# EAGLE design quad.decay.v1.0.1 (EAGLE 7.7.0)
VCA
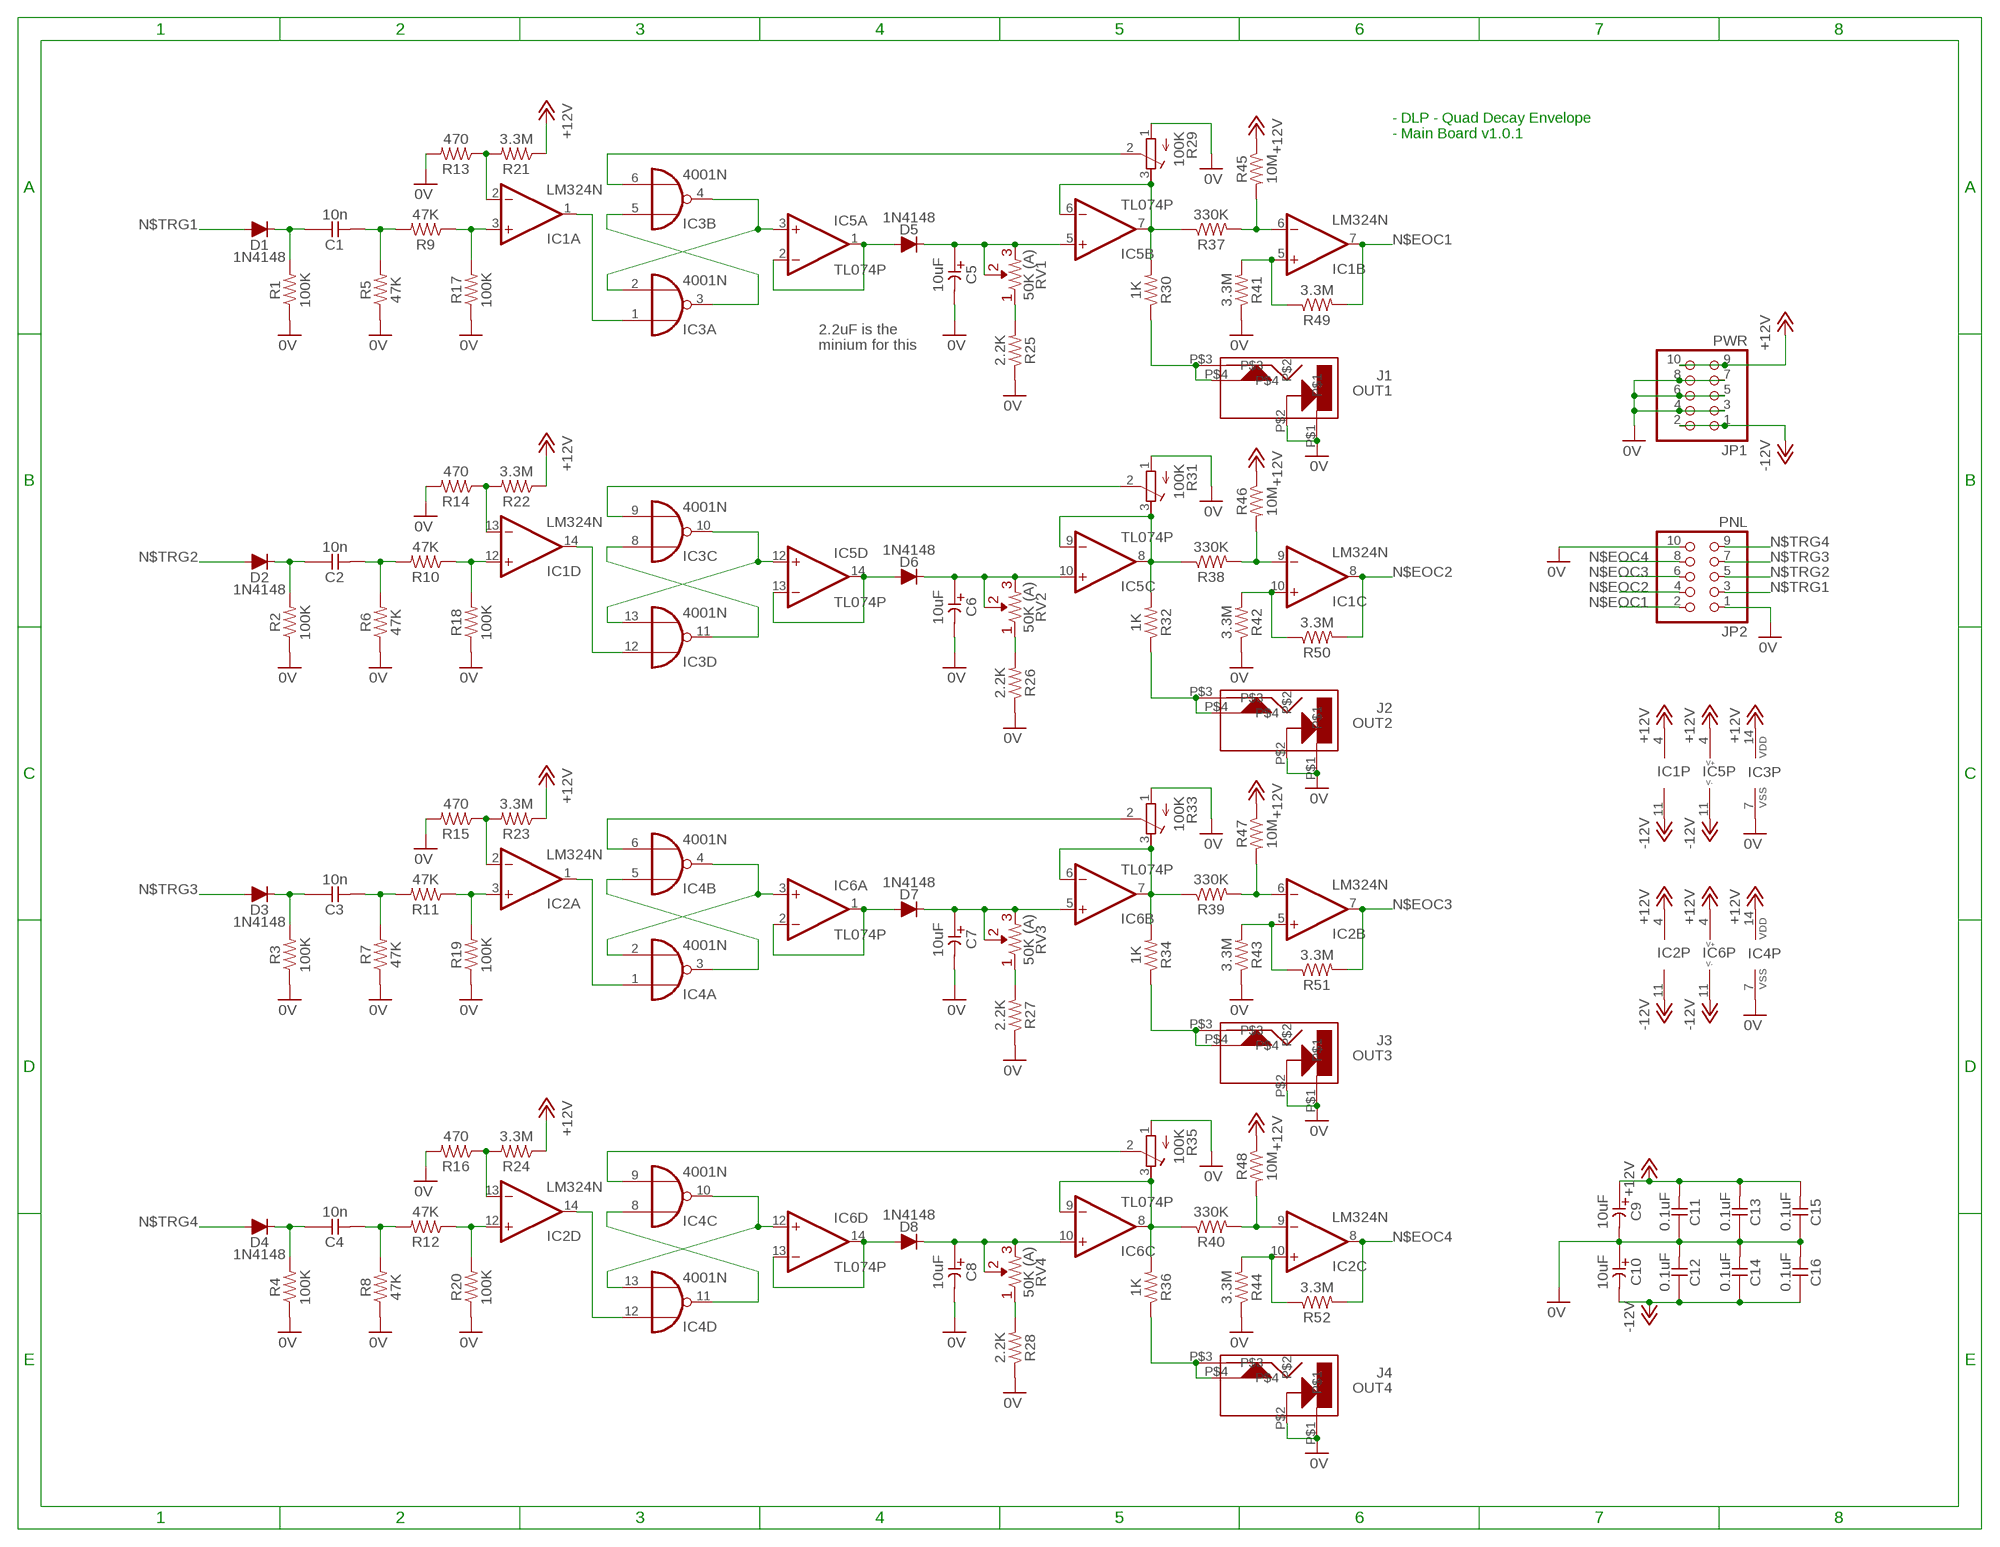
[diagram p0: schematic, sheet 1]

## Parts
C1  10n  CC-US025-024X044  [C025-024X044]
C2  10n  CC-US025-024X044  [C025-024X044]
C3  10n  CC-US025-024X044  [C025-024X044]
C4  10n  CC-US025-024X044  [C025-024X044]
C5  10uF  CE-USE2-5  [E2-5]
C6  10uF  CE-USE2-5  [E2-5]
C7  10uF  CE-USE2-5  [E2-5]
C8  10uF  CE-USE2-5  [E2-5]
C9  10uF  CE-USE2-5  [E2-5]
C10  10uF  CE-USE2-5  [E2-5]
C11  0.1uF  CC-US025-024X044  [C025-024X044]
C12  0.1uF  CC-US025-024X044  [C025-024X044]
C13  0.1uF  CC-US025-024X044  [C025-024X044]
C14  0.1uF  CC-US025-024X044  [C025-024X044]
C15  0.1uF  CC-US025-024X044  [C025-024X044]
C16  0.1uF  CC-US025-024X044  [C025-024X044]
D1  1N4148  [DO34-5]
D2  1N4148  [DO34-5]
D3  1N4148  [DO34-5]
D4  1N4148  [DO34-5]
D5  1N4148  [DO34-5]
D6  1N4148  [DO34-5]
D7  1N4148  [DO34-5]
D8  1N4148  [DO34-5]
IC1  LM324N  [DIL14]
IC2  LM324N  [DIL14]
IC3  4001N  [DIL14]
IC4  4001N  [DIL14]
IC5  TL074P  [DIL14]
IC6  TL074P  [DIL14]
J1  OUT1  CL1384  [CL1384]
J2  OUT2  CL1384  [CL1384]
J3  OUT3  CL1384  [CL1384]
J4  OUT4  CL1384  [CL1384]
JP1  PWR  PINHD-2X5  [2X05]
JP2  PNL  PINHD-2X5  [2X05]
R1  100K  R  [0207/7]
R2  100K  R  [0207/7]
R3  100K  R  [0207/7]
R4  100K  R  [0207/7]
R5  47K  R  [0207/7]
R6  47K  R  [0207/7]
R7  47K  R  [0207/7]
R8  47K  R  [0207/7]
R9  47K  R  [0207/7]
R10  47K  R  [0207/7]
R11  47K  R  [0207/7]
R12  47K  R  [0207/7]
R13  470  R  [0207/7]
R14  470  R  [0207/7]
R15  470  R  [0207/7]
R16  470  R  [0207/7]
R17  100K  R  [0207/7]
R18  100K  R  [0207/7]
R19  100K  R  [0207/7]
R20  100K  R  [0207/7]
R21  3.3M  R  [0207/7]
R22  3.3M  R  [0207/7]
R23  3.3M  R  [0207/7]
R24  3.3M  R  [0207/7]
R25  2.2K  R  [0207/7]
R26  2.2K  R  [0207/7]
R27  2.2K  R  [0207/7]
R28  2.2K  R  [0207/7]
R29  100K  R-TRIMM3339P  [RTRIM3339P]
R30  1K  R  [0207/7]
R31  100K  R-TRIMM3339P  [RTRIM3339P]
R32  1K  R  [0207/7]
R33  100K  R-TRIMM3339P  [RTRIM3339P]
R34  1K  R  [0207/7]
R35  100K  R-TRIMM3339P  [RTRIM3339P]
R36  1K  R  [0207/7]
R37  330K  R  [0207/7]
R38  330K  R  [0207/7]
R39  330K  R  [0207/7]
R40  330K  R  [0207/7]
R41  3.3M  R  [0207/7]
R42  3.3M  R  [0207/7]
R43  3.3M  R  [0207/7]
R44  3.3M  R  [0207/7]
R45  10M  R  [0207/7]
R46  10M  R  [0207/7]
R47  10M  R  [0207/7]
R48  10M  R  [0207/7]
R49  3.3M  R  [0207/7]
R50  3.3M  R  [0207/7]
R51  3.3M  R  [0207/7]
R52  3.3M  R  [0207/7]
RV1  50K (A)  R-VAR  [R-VAR]
RV2  50K (A)  R-VAR  [R-VAR]
RV3  50K (A)  R-VAR  [R-VAR]
RV4  50K (A)  R-VAR  [R-VAR]

## Nets
0V [pwr]: C5.- C6.- C7.- C8.- C9.- C10.+ C11.1 C12.2 C13.1 C14.2 C15.1 C16.2 IC3.7(P:VSS) IC4.7(P:VSS) J1.P$1 J1.P$2 J2.P$1 J2.P$2 J3.P$1 J3.P$2 J4.P$1 J4.P$2 JP1.3 JP1.4 JP1.5 JP1.6 JP1.7 JP1.8 JP2.1 JP2.10 R1.1 R2.1 R3.1 R4.1 R5.1 R6.1 R7.1 R8.1 R13.2 R14.2 R15.2 R16.2 R17.1 R18.1 R19.1 R20.1 R25.1 R26.1 R27.1 R28.1 R29.1(A) R31.1(A) R33.1(A) R35.1(A) R41.1 R42.1 R43.1 R44.1
+12V [pwr]: C9.+ C11.2 C13.2 C15.2 IC1.4(P:V+) IC2.4(P:V+) IC3.14(P:VDD) IC4.14(P:VDD) IC5.4(P:V+) IC6.4(P:V+) JP1.9 JP1.10 R21.1 R22.1 R23.1 R24.1 R45.1 R46.1 R47.1 R48.1
-12V [pwr]: C10.- C12.1 C14.1 C16.1 IC1.11(P:V-) IC2.11(P:V-) IC5.11(P:V-) IC6.11(P:V-) JP1.1 JP1.2
N$1: R25.2 RV1.R1
N$2: IC1.6(B:-IN) R37.2 R45.2
N$3: IC1.5(B:+IN) R41.2 R49.1
N$4: IC3.3(A:O) IC3.5(B:I0)
N$8: IC3.8(C:I0) IC3.11(D:O)
N$9: IC3.10(C:O) IC3.13(D:I1) IC5.12(D:+IN)
N$11: C2.1 D2.C R2.2
N$12: C2.2 R6.2 R10.2
N$13: IC1.12(D:+IN) R10.1 R18.2
N$14: IC3.2(A:I1) IC3.4(B:O) IC5.3(A:+IN)
N$16: IC1.13(D:-IN) R14.1 R22.2
N$17: D5.A IC5.1(A:OUT) IC5.2(A:-IN)
N$18: C1.1 D1.C R1.2
N$19: C1.2 R5.2 R9.2
N$20: IC1.3(A:+IN) R9.1 R17.2
N$21: IC1.2(A:-IN) R13.1 R21.2
N$22: IC1.1(A:OUT) IC3.1(A:I0)
N$23: IC5.6(B:-IN) IC5.7(B:OUT) R29.3(E) R30.2 R37.1
N$24: J1.P$3 J1.P$4 R30.1
N$25: IC3.6(B:I1) R29.2(S)
N$26: IC1.14(D:OUT) IC3.12(D:I0)
N$27: D6.A IC5.13(D:-IN) IC5.14(D:OUT)
N$28: IC5.8(C:OUT) IC5.9(C:-IN) R31.3(E) R32.2 R38.1
N$29: J2.P$3 J2.P$4 R32.1
N$30: IC3.9(C:I1) R31.2(S)
N$31: C6.+ D6.C IC5.10(C:+IN) RV2.R2 RV2.VAR
N$32: R26.2 RV2.R1
N$33: IC1.9(C:-IN) R38.2 R46.2
N$34: IC1.10(C:+IN) R42.2 R50.1
N$38: IC4.3(A:O) IC4.5(B:I0)
N$39: IC4.2(A:I1) IC4.4(B:O) IC6.3(A:+IN)
N$41: C3.1 D3.C R3.2
N$42: C3.2 R7.2 R11.2
N$43: IC2.3(A:+IN) R11.1 R19.2
N$44: IC2.2(A:-IN) R15.1 R23.2
N$45: IC2.1(A:OUT) IC4.1(A:I0)
N$46: D7.A IC6.1(A:OUT) IC6.2(A:-IN)
N$47: IC6.6(B:-IN) IC6.7(B:OUT) R33.3(E) R34.2 R39.1
N$48: J3.P$3 J3.P$4 R34.1
N$49: IC4.6(B:I1) R33.2(S)
N$50: C7.+ D7.C IC6.5(B:+IN) RV3.R2 RV3.VAR
N$51: R27.2 RV3.R1
N$52: IC2.6(B:-IN) R39.2 R47.2
N$53: IC2.5(B:+IN) R43.2 R51.1
N$57: IC4.8(C:I0) IC4.11(D:O)
N$58: IC4.10(C:O) IC4.13(D:I1) IC6.12(D:+IN)
N$60: C4.1 D4.C R4.2
N$61: C4.2 R8.2 R12.2
N$62: IC2.12(D:+IN) R12.1 R20.2
N$63: C5.+ D5.C IC5.5(B:+IN) RV1.R2 RV1.VAR
N$64: IC2.13(D:-IN) R16.1 R24.2
N$65: IC2.14(D:OUT) IC4.12(D:I0)
N$66: D8.A IC6.13(D:-IN) IC6.14(D:OUT)
N$67: IC6.8(C:OUT) IC6.9(C:-IN) R35.3(E) R36.2 R40.1
N$68: J4.P$3 J4.P$4 R36.1
N$69: IC4.9(C:I1) R35.2(S)
N$70: C8.+ D8.C IC6.10(C:+IN) RV4.R2 RV4.VAR
N$71: R28.2 RV4.R1
N$72: IC2.9(C:-IN) R40.2 R48.2
N$73: IC2.10(C:+IN) R44.2 R52.1
N$EOC1: IC1.7(B:OUT) JP2.2 R49.2
N$EOC2: IC1.8(C:OUT) JP2.4 R50.2
N$EOC3: IC2.7(B:OUT) JP2.6 R51.2
N$EOC4: IC2.8(C:OUT) JP2.8 R52.2
N$TRG1: D1.A JP2.3
N$TRG2: D2.A JP2.5
N$TRG3: D3.A JP2.7
N$TRG4: D4.A JP2.9

## Notes on the sheet
- - DLP - Quad Decay Envelope
  - Main Board v1.0.1
- 2.2uF is the 
  minium for this

## Library data of the parts
C1-C4 C11-C16 = _common:CC-US: CAPACITOR, US symbol
C5-C10 = _common:CE-US: ELECTROLYTIC CAPACITOR, US symbol
D1-D8 = _common:1N4148: DIODE high speed (Philips)
IC1 IC2 = linear:LM324: OP AMP
IC3 IC4 = 40xx:4001: Quad 2-input NOR
IC5 IC6 = _common:TL074: OP AMP
J1-J4 = jacks:CL1384
JP1 JP2 = pinhead:PINHD-2X5: PIN HEADER
R1-R28 R30 R32 R34 R36-R52 = _common:R: RESISTOR, US symbol
R29 R31 R33 R35 = rcl:R-TRIMM: Trimm resistor
RV1-RV4 = _common:R-VAR

## Net classes
1 pwr: width 0.508 mm

## Board
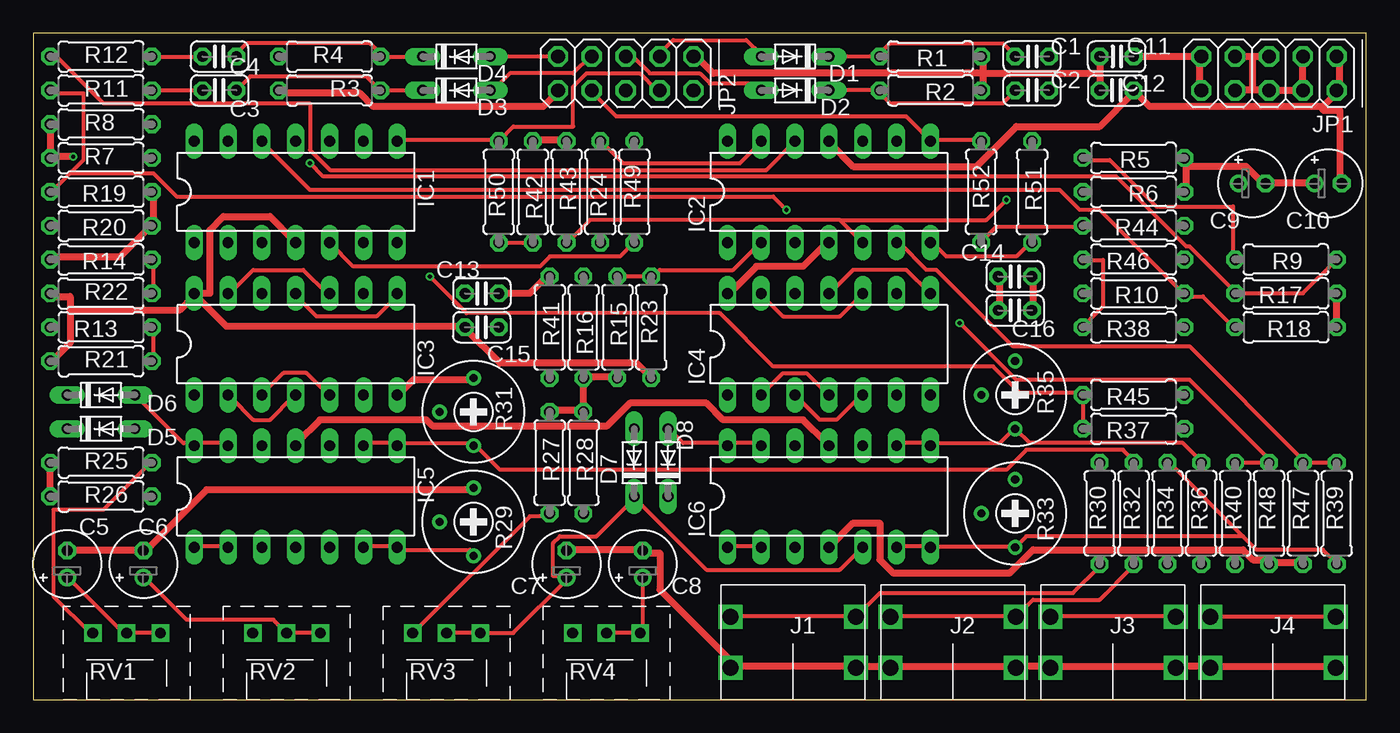
[diagram p1: board, top side]
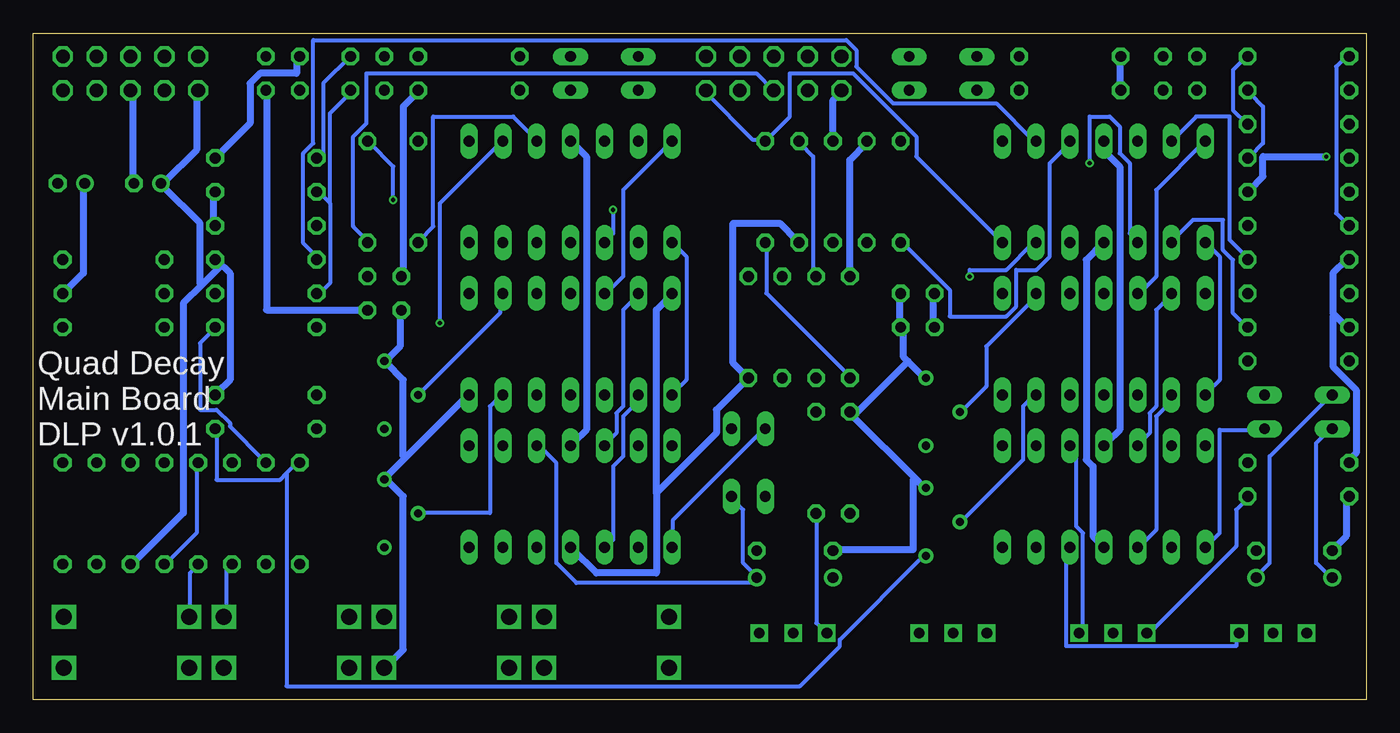
[diagram p2: board, bottom side, seen from below]

Size 100 x 50 mm. Coordinates in mm from the lower left corner, seen from the top.
Outline: 0,0 100,0 100,50 0,50 0,0
Copper layers (1*16): Top 0.035mm / dielectric 1.5mm / Bottom 0.035mm
Design rules "SeeedStudio_2layer_DRU_no_angle_20140221 *": minimum track width 12mil, minimum drill 12mil, track to track 6mil, track to pad 6mil, pad to pad 6mil, via to via 6mil, smd to smd 0mil, copper to edge 10mil, drill to drill 10mil, minimum pad ring 10mil, minimum via ring 6mil, stop-mask expansion 2mil, vias tented up to drill 100mil, thermal gap 10mil

### Footprints (pad centres in the part's own frame; a part is rotated, then mirrored left to right if it is on the bottom)
C025-024X044 = drill 0.813 octagon: 1 -1.27,0; 2 1.27,0
E2-5 = drill 0.813 pad 1.27: + -1.016,0 | drill 0.813 pad 1.27 octagon: - 1.016,0
DO34-5 = drill 0.813 long: A 2.54,0; C -2.54,0
DIL14 = drill 0.813 long: 1 -7.62,-3.81; 2 -5.08,-3.81; 3 -2.54,-3.81; 4 0,-3.81; 5 2.54,-3.81; 6 5.08,-3.81; 7 7.62,-3.81; 8 7.62,3.81; 9 5.08,3.81; 10 2.54,3.81; 11 0,3.81; 12 -2.54,3.81; 13 -5.08,3.81; 14 -7.62,3.81
CL1384 = drill 1.2 square: P$1 0,0; P$2 9.4,0; P$3 0,-3.8; P$4 9.4,-3.8
2X05 = drill 1.016 octagon: 1 -5.08,-1.27; 2 -5.08,1.27; 3 -2.54,-1.27; 4 -2.54,1.27; 5 0,-1.27; 6 0,1.27; 7 2.54,-1.27; 8 2.54,1.27; 9 5.08,-1.27; 10 5.08,1.27
0207/7 = drill 0.813 octagon: 1 -3.81,0; 2 3.81,0
RTRIM3339P = drill 0.61: 1 -2.54,0; 2 0,-2.54; 3 2.54,0
R-VAR = drill 0.8 square: R1 -2.54,0; R2 2.54,0; VAR 0,0

### Placement (x,y rotation side)
C1  74.93,48.26 0 top
C2  74.93,45.72 0 top
C3  13.97,45.72 180 top
C4  13.97,48.26 180 top
C5  2.54,10.16 90 top
C6  8.26,10.16 90 top
C7  40.01,10.16 90 top
C8  45.72,10.16 90 top
C9  91.44,38.73 0 top
C10  97.16,38.73 0 top
C11  81.28,48.26 0 top
C12  81.28,45.72 180 top
C13  33.66,30.48 180 top
C14  73.66,31.75 180 top
C15  33.66,27.94 180 top
C16  73.66,29.21 180 top
D1  57.15,48.26 180 top
D2  57.15,45.72 180 top
D3  31.75,45.72 0 top
D4  31.75,48.26 0 top
D5  5.08,20.32 0 top
D6  5.08,22.86 0 top
D7  45.09,17.78 90 top
D8  47.62,17.78 90 top
IC1  19.68,38.1 0 top
IC2  59.69,38.1 0 top
IC3  19.68,26.67 0 top
IC4  59.69,26.67 0 top
IC5  19.68,15.24 0 top
IC6  59.69,15.24 0 top
J1  61.7,2.4 180 top
J2  73.7,2.4 180 top
J3  85.7,2.4 180 top
J4  97.7,2.4 180 top
JP1  92.71,46.99 180 top
JP2  44.45,46.99 180 top
R1  67.31,48.26 180 top
R2  67.31,45.72 180 top
R3  22.23,45.72 0 top
R4  22.23,48.26 0 top
R5  82.55,40.64 180 top
R6  82.55,38.1 180 top
R7  5.08,40.64 0 top
R8  5.08,43.18 0 top
R9  93.98,33.02 180 top
R10  82.55,30.48 180 top
R11  5.08,45.72 0 top
R12  5.08,48.26 0 top
R13  5.08,27.94 180 top
R14  5.08,33.02 180 top
R15  43.81,27.94 270 top
R16  41.27,27.94 270 top
R17  93.98,30.48 180 top
R18  93.98,27.94 180 top
R19  5.08,38.1 180 top
R20  5.08,35.56 180 top
R21  5.08,25.4 0 top
R22  5.08,30.48 0 top
R23  46.35,27.94 90 top
R24  42.55,38.1 90 top
R25  5.08,17.78 0 top
R26  5.08,15.24 0 top
R27  38.73,17.78 270 top
R28  41.27,17.78 270 top
R29  33.02,13.34 270 top
R30  80.01,13.97 90 top
R31  33.02,21.59 270 top
R32  82.55,13.97 90 top
R33  73.66,13.97 270 top
R34  85.09,13.97 90 top
R35  73.66,22.86 270 top
R36  87.63,13.97 90 top
R37  82.55,20.32 180 top
R38  82.55,27.94 180 top
R39  97.79,13.97 90 top
R40  90.17,13.97 90 top
R41  38.73,27.94 270 top
R42  37.47,38.1 270 top
R43  40.01,38.1 270 top
R44  82.55,35.56 180 top
R45  82.55,22.86 180 top
R46  82.55,33.02 180 top
R47  95.25,13.97 90 top
R48  92.71,13.97 90 top
R49  45.09,38.1 90 top
R50  34.92,38.1 90 top
R51  74.93,38.1 270 top
R52  71.12,38.1 90 top
RV1  7,5 0 top
RV2  19,5 0 top
RV3  31,5 0 top
RV4  43,5 0 top

### Tracks (layer width: path | path; a pad name or v marks a point on that pad's centre or on a via)
0V  (via drill 0.3)
  Top 0.508: 91.5,48.25 92.5,48.25 JP1.5 | 91.5,48.25 90.25,48.25 JP1.7 | 91.5,45.75 92.5,45.75 JP1.6 92.75,45.75 95.25,45.75 JP1.4 JP1.3 | 91.5,45.75 90.25,45.75 JP1.8 | 91.5,45.75 91.5,48.25 | 86.5,40 86.5,38.25 R6.1 | 86.5,40 86.5,40.5 R5.1 | R18.1 97.75,28 97.75,30.25 R17.1 | C10.+ 96,38.75 92.5,38.75 C9.- 92.25,38.75 91,40 86.5,40 | C14.2 72.5,31.75 72.5,29.25 C16.2 | 80,47 C11.1 | 80,47 80,45.75 C12.2 | 71.25,47 71.25,48.25 R1.1 | 71.25,47 71.25,45.75 R2.1 | 71.25,47 51,47 49.75,48.25 JP2.1 | 71.25,47 80,47 | J4.P$1 97.5,2.5 88.5,2.5 J4.P$2 88.25,2.5 85.75,2.5 J3.P$1 85.5,2.5 76.5,2.5 J3.P$2 76.25,2.5 73.75,2.5 J2.P$1 73.5,2.5 64.5,2.5 J2.P$2 64.25,2.5 61.75,2.5 J1.P$1 61.5,2.5 52.5,2.5 J1.P$2 52.5,2.75 47,8.25 47,11 45.75,11 C8.- 45.5,11.25 40.25,11.25 C7.- | C5.- 2.75,11.25 8.25,11.25 C6.- 8.5,11.25 13,15.75 33,15.75 R29.1 | R25.1 1.25,17.75 1.25,15.25 R26.1 | R8.1 1.25,43 1.25,40.75 R7.1 1.5,40.75 v3,40.75 | R19.1 9,38 9,35.75 R20.1 8.75,35.5 6.5,33.25 1.5,33.25 R14.2 | R42.1 37.5,42 40,42 R43.1 | R3.1 18.5,45.5 24.5,45.5 25.5,44.5 38.25,44.5 39.25,45.5 JP2.10 | IC3.7 27.5,23 28.5,24 33,24 R31.1 | R41.1 38.5,31.75 37.25,30.5 35,30.5 C13.1 | R15.2 43.75,24.25 41.5,24.25 R16.2 41.25,24 41.25,21.75 R28.1 41,21.75 38.75,21.75 R27.1
  Bottom 0.508: R44.1 86.5,35.75 86.5,38 R6.1 | R17.1 97.75,30.5 96.25,32 96.25,38.5 C10.+ | JP1.6 92.5,45.5 92.5,38.75 C9.- | C16.2 72.5,29 72.5,26.5 73.5,25.5 R35.1 73.5,25.25 72.25,24 72.25,18.25 72.12,18.12 | 72.12,18.12 67.5,22.75 IC4.7 | 72.12,18.12 73.5,16.75 R33.1 73.5,16.5 72.25,15.25 72.25,3.75 73.5,2.5 J2.P$1 | C14.2 72.25,31.75 72.25,44.5 71.25,45.5 R2.1 | R5.1 83.75,43.25 83.75,46.25 83,47 80.25,47 80.25,48.25 C11.1 | C5.- 2.5,11.25 1.5,12.25 1.5,15 R26.1 | 2.38,28.88 2.5,29 2.5,32 1.5,33 R14.2 | 2.38,28.88 1.5,28 R13.2 | v3,40.75 7.75,40.75 7.75,39.25 8.75,38.25 R19.1 | R25.1 1.25,18 0.75,18.5 0.75,23.25 2.5,25 2.5,28.75 2.38,28.88 | R3.1 18.5,45.75 18.5,48.25 R4.1 | JP2.10 39.5,45.5 40,45 40,42 R43.1 | 34.38,25.38 34.75,25.75 34.75,27.75 C15.1 35,28 35,30.25 C13.1 | 34.38,25.38 33.25,24.25 R31.1 | 33.88,16.62 38.5,21.25 38.5,21.5 R27.1 38.25,21.5 34.38,25.38 | 33.88,16.62 33.25,16 R29.1 | C7.- 40,11.25 34,11.25 34,16.5 33.88,16.62 | R42.1 37.5,41.75 38.75,40.5 38.75,31.75 R41.1
+12V
  Top 0.508: C11.2 82.75,48.25 87.5,48.25 JP1.9 87.5,48 87.5,45.75 JP1.10 | R47.1 95.25,10.25 92.75,10.25 R48.1 92.5,10.25 92.25,10.5 91.5,10.5 90.75,11.25 75,11.25 73.25,9.5 64.5,9.5 63.5,10.5 63.5,13.25 61.5,13.25 59.75,11.5 IC6.4 | 2.75,29.25 2.75,30.25 1.5,30.25 R22.1 | 2.75,29.25 2.75,26.75 1.5,25.5 R21.1 | 2.75,29.25 11,29.25 12,30.25 IC3.14 | IC4.14 52.25,30.5 54.25,32.5 57.75,32.5 59.5,34.25 IC2.4 | R23.1 46.25,24.25 45.25,25.25 35,25.25 32.5,27.75 C15.2 32.25,28 14.5,28 12.25,30.25 IC3.14 | IC1.4 19.5,34.5 17.75,36.25 14.25,36.25 13.25,35.25 13.25,30.5 12.25,30.5 IC3.14
  Bottom 0.508: JP1.10 87.75,45.5 87.75,41.25 90.25,38.75 C9.+ 90.25,38.5 87.5,35.75 87.5,31.25 87.38,31.12 | R45.1 86.25,23 85.25,24 85.25,32 86.25,33 R46.1 86,32.5 87.38,31.12 | 87.38,31.12 88.75,29.75 88.75,14 92.5,10.25 R48.1 | IC5.4 19.75,11.5 20.5,12.25 20.5,17.5 21,18 21,33 19.75,34.25 IC1.4 | C15.2 32.5,28 32.5,30.25 C13.2 | R24.1 42.75,34.5 44,35.75 47.5,35.75 47.5,25.25 46.5,24.25 R23.1 46.5,24 48.75,21.75 48.75,20 53.25,15.5 | 53.25,15.5 53.25,9.5 57.75,9.5 59.5,11.25 IC6.4 | 53.25,15.5 53.25,29.25 52.25,30.25 IC4.14
-12V
  Top 0.508: C16.1 75,29.25 75,31.75 C14.1 | 96.75,44.5 83.75,44.5 82.75,45.5 C12.1 82.5,45.5 80,43 73.75,43 70.75,40 61.5,40 59.75,41.75 IC2.11 | 96.75,44.5 97.75,45.5 JP1.2 98,45.75 98,48.25 JP1.1 | C10.- 98,38.75 98,44.25 96.75,44.25 96.75,44.5 | IC5.11 19.75,19.25 21.5,21 29.5,21 30,20.5 43,20.5 44.75,22.25 50.5,22.25 51.75,21 57.75,21 59.5,19.25 IC6.11
  Bottom 0.508: C16.1 75,29.25 82.5,29.25 82.5,45.5 C12.1 | IC5.11 19.5,19.25 18.5,20.25 18.5,40 19.5,41 19.5,41.75 IC1.11 | IC6.11 59.5,19.25 58.5,20.25 58.5,40.75 59.5,41.75 IC2.11
N$1
  Top 0.305: RV1.R1 4.25,5 1.5,7.75 1.5,14.25 5.25,14.25 8.75,17.75 R25.2
N$2  (via drill 0.3)
  Top 0.305: R37.2 78.75,20.5 78.75,22.75 R45.2 78.5,23 74,23 72,25 55.5,25 51.5,29 32.5,29 v29.75,31.75
  Bottom 0.305: v29.75,31.75 29.75,32.25 27,32.25 25,34.25 IC1.6
N$3
  Top 0.305: IC1.5 22.25,34.25 24,32.5 38,32.5 38.75,33.25 44,33.25 45,34.25 R49.1
  Bottom 0.305: R41.2 38.75,24.25 45,30.5 45,34.25 R49.1
N$4
  Top 0.305: IC3.3 17.25,23 18.75,24.5 20.5,24.5 22,23 IC3.5
N$8
  Top 0.305: IC3.11 19.75,30.25 21.25,28.75 25.75,28.75 27.25,30.25 IC3.8
N$9
  Top 0.305: IC3.10 22,30.5 20.25,32.25 16.5,32.25 14.75,30.5 IC3.13
  Bottom 0.305: IC5.12 17,19.25 16.25,20 16.25,21.5 15.75,22 15.75,29.25 14.75,30.25 IC3.13
N$11
  Top 0.305: D2.C 59.75,45.75 63.5,45.75 R2.2 63.5,45.5 64.25,44.75 72.75,44.75 73.5,45.5 C2.1
N$12
  Bottom 0.305: 77.75,37.25 77.75,31.25 78.5,30.5 R10.2 | 77.75,37.25 78.5,38 R6.2 | 77.75,37.25 77.75,44 76.25,45.5 C2.2
N$13
  Top 0.305: IC1.12 17.25,41.75 20.75,38.25 77,38.25 78.5,36.75 80,36.75 86.25,30.5 R10.1 86.5,30.25 87.75,30.25 90,28 R18.2
N$14
  Top 0.305: IC3.4 19.5,22.75 17.75,21 16.5,21 14.75,22.75 IC3.2
  Bottom 0.305: IC5.3 17,11.5 15.75,12.75 15.75,21.25 14.75,22.25 14.75,22.75 IC3.2
N$16
  Top 0.305: R22.2 9,30.5 9,33 R14.1
  Bottom 0.305: IC1.13 14.5,42 12.75,43.75 10.25,43.75 10.25,34.5 9,33.25 R14.1
N$17
  Top 0.305: IC5.1 12.25,11.5 14.5,11.5 IC5.2
  Bottom 0.305: D5.A 7.75,20.25 11,20.25 11,12.5 12,11.5 IC5.1
N$18
  Top 0.305: D1.C 59.75,48.25 R1.2 63.5,48.5 64.25,49.25 72.75,49.25 73.5,48.5 C1.1
N$19
  Top 0.305: R9.2 90,33.25 90,37 84.25,37 80.75,40.5 78.75,40.5 R5.2
  Bottom 0.305: R5.2 78.5,40.75 78.25,41 78.25,46.25 76.25,48.25 C1.2
N$20  (via drill 0.3)
  Top 0.305: v20.75,40.25 21.75,39.25 81.25,39.25 86.5,34 86.75,34 90.25,30.5 | 90.25,30.5 95.25,30.5 97.75,33 R9.1 | 90.25,30.5 R17.2
  Bottom 0.305: v20.75,40.25 20.75,43.75 19.25,43.75 18.5,43 18.5,41 17.75,40.25 17.75,35 17.25,34.5 IC1.3
N$21
  Top 0.305: R21.2 9,25.5 9,27.75 R13.1
  Bottom 0.305: IC1.2 14.5,34.5 13,36 10.75,36 10.75,33.75 10,33 10,29 9,28 R13.1
N$22
  Bottom 0.305: IC3.1 12,23 11,24 11,33.25 12,34.25 IC1.1
N$23
  Top 0.305: R29.3 33,11 32.75,11.25 27.5,11.25 IC5.7 27.25,11.5 25,11.5 IC5.6
  Bottom 0.305: 81,17 81.5,16.5 86.25,16.5 86.25,20.25 R37.1 | 81,17 80.25,17.75 R30.2 | 81,17 81,1 42.5,1 39.5,4 39.5,4.5 33.25,10.75 R29.3
N$24
  Top 0.305: R30.1 80,10 78,8 63.5,8 J1.P$3 61.5,6.25 52.5,6.25 J1.P$4
N$25
  Bottom 0.305: R29.2 30.25,13.5 25.75,18 25.75,22 25,22.75 IC3.6
N$26
  Bottom 0.305: IC3.12 17,30.5 15.75,31.75 15.75,38.25 12.25,41.75 IC1.14
N$27
  Top 0.305: IC5.13 14.5,19.25 12.25,19.25 IC5.14 12,19.25 11.25,19.25 7.75,22.75 D6.A
N$28
  Top 0.305: IC5.9 25,19.25 27.25,19.25 IC5.8 27.5,19.25 33,19.25 R31.3 33.25,19 35,17.25 73,17.25 74.5,18.75 81.75,18.75 82.5,18 R32.2
  Bottom 0.305: R32.2 82.75,18 85.25,20.5 85.25,20.75 86.25,21.75 87.5,21.75 87.5,26.75 86.5,27.75 R38.1
N$29
  Top 0.305: R32.1 82.5,10 80,7.5 75,7.5 J2.P$3 73.5,6.25 64.5,6.25 J2.P$4
N$30
  Bottom 0.305: R31.2 30.25,21.75 28.5,23.5 28.5,26.5 25,30 25,30.25 IC3.9
N$31
  Top 0.305: RV2.R2 RV2.VAR 18,6 11.5,6 8.5,9 C6.+
  Bottom 0.305: D6.C 2.75,22.75 7.25,18.25 7.25,10.25 8.25,9.25 C6.+ | IC5.10 22,19 21.75,18.75 21.75,13 21.25,12.5 21.25,5.25 21.5,5 RV2.R2
N$32
  Bottom 0.305: RV2.R1 16.25,5 9.75,11.5 9.75,14.25 9,15 R26.2
N$33
  Top 0.305: R38.2 78.75,28 80.25,29.5 80.25,33 78.75,33 R46.2
  Bottom 0.305: IC1.9 25,42 27.75,44.75 35.5,44.75 38.25,47.5 38.25,48.75 39,49.5 79,49.5 79,41.75 79.75,41 79.75,34.25 78.75,33.25 R46.2
N$34
  Top 0.305: R50.1 35,34.25 37.25,34.25 R42.2
  Bottom 0.305: IC1.10 22.25,41.75 23.75,40.25 23.75,33.25 24.75,32.25 26.25,32.25 26.25,29.5 27,28.75 31.25,28.75 31.25,30.75 34.75,34.25 R50.1
N$38
  Top 0.305: IC4.3 57.25,22.75 59,21 60.25,21 62,22.75 IC4.5
N$39
  Top 0.305: IC4.2 56.25,24.5 58,24.5 59.5,23 IC4.4
  Bottom 0.305: IC6.3 57,11.5 56.5,12 56.5,17.5 55.75,18.25 55.75,21.25 54.75,22.25 54.75,22.75 IC4.2
N$41
  Top 0.305: C3.1 15.25,45.75 16.25,46.75 25,46.75 26,45.75 R3.2 26.25,45.75 29,45.75 D3.C
N$42
  Top 0.305: C3.2 12.5,45.75 9,45.75 R11.2
  Bottom 0.305: R7.2 8.75,40.75 7.75,41.75 7.75,44.5 8.75,45.5 R11.2
N$43  (via drill 0.3)
  Top 0.305: 2.75,39.5 3.75,40.5 3.75,45.5 1.5,45.5 R11.1 | 2.75,39.5 1.5,38.25 R19.2 | v56.5,36.75 55.5,37.75 10.75,37.75 9,39.5 2.75,39.5
  Bottom 0.305: v56.5,36.75 56.5,35 57,34.5 IC2.3
N$44
  Top 0.305: R15.1 R23.2 46.5,31.75 47,32.25 52.5,32.25 54.5,34.25 IC2.2
N$45
  Bottom 0.305: IC4.1 52,23 51,24 51,33.25 52,34.25 IC2.1
N$46
  Top 0.305: IC6.1 52.25,11.5 54.5,11.5 IC6.2
  Bottom 0.305: D7.A 45.25,20.25 52,13.5 52,11.5 IC6.1
N$47
  Top 0.305: IC6.6 65,11.5 67.25,11.5 IC6.7 67.5,11.5 73.5,11.5 R33.3 73.75,11.5 74.5,12.25 90.75,12.25 | 90.75,12.25 91.75,11.25 96.75,11.25 97.75,10.25 R39.1 | 90.75,12.25 85.25,17.75 R34.2
N$48
  Top 0.305: J3.P$4 76.5,6.25 85.5,6.25 J3.P$3
  Bottom 0.305: R34.1 85.5,9.75 85.5,6.25 J3.P$3
N$49
  Bottom 0.305: R33.2 71,14 65.75,14 65.75,22 65,22.75 IC4.6
N$50
  Top 0.305: RV3.VAR RV3.R2 36,5 40,9 C7.+ 40,9.25 39,9.25 39,11.75 39.5,12.25 42.25,12.25 45,15 D7.C 45.25,15 50.5,9.75 60.5,9.75 62,11.25 IC6.5
N$51
  Top 0.305: RV3.R1 28.5,5 37.25,13.75 38.5,13.75 R27.2
N$52
  Top 0.305: R39.2 97.75,17.75 95.25,17.75 R47.2 95.25,18 86.75,26.5 73.5,26.5 67.75,32.25 67,32.25 65,34.25 IC2.6
N$53  (via drill 0.3)
  Top 0.305: 60.5,36 41.75,36 40.25,34.5 R43.2 | 60.5,36 62,34.5 IC2.5 | v73,37.5 71.5,36 60.5,36
  Bottom 0.305: v73,37.5 73,40 74.75,41.75 R51.1
N$57
  Top 0.305: IC4.11 59.75,30.5 61.5,32.25 65.5,32.25 67.25,30.5 IC4.8
N$58
  Top 0.305: IC4.10 60.5,28.75 56.25,28.75 54.75,30.25 IC4.13
  Bottom 0.305: IC6.12 57,19.25 56.25,20 56.25,21.5 55.75,22 55.75,29.25 54.75,30.25 IC4.13
N$60
  Top 0.305: C4.1 15.25,48.5 16,49.25 25.25,49.25 26,48.5 R4.2 26.25,48.25 29,48.25 D4.C
N$61
  Top 0.305: C4.2 12.5,48.25 9,48.25 R12.2
  Bottom 0.305: R8.2 9,43.25 10,44.25 10,47.25 9,48.25 R12.2
N$62
  Top 0.305: IC2.12 57,41.75 55,39.75 22.25,39.75 20.75,41.25 20.75,44.75 5.25,44.75 1.75,48.25 1.5,48.25 R12.1
  Bottom 0.305: R20.2 1.5,35.75 2.25,36.5 2.25,47.5 1.5,48.25 R12.1
N$63
  Top 0.305: RV1.R2 RV1.VAR 6.75,5 2.75,9 C5.+
  Bottom 0.305: IC5.5 22.25,11.25 22.5,11 22.5,4 9.75,4 9.75,5 RV1.R2 | D5.C 2.75,20.25 3.75,19.25 3.75,10.25 2.75,9.25 C5.+
N$64
  Top 0.305: IC2.13 54.5,41.75 53,40.25 44.25,40.25 42.75,41.75 R24.2
  Bottom 0.305: R16.1 41.5,31.75 41.5,40.75 42.5,41.75 R24.2
N$65
  Bottom 0.305: IC4.12 57,30.5 55.75,31.75 55.75,38.25 52.25,41.75 IC2.14
N$66
  Top 0.305: IC6.13 54.5,19.25 52.25,19.25 IC6.14 52,19.25 48.75,19.25 47.75,20.25 D8.A
N$67
  Top 0.305: IC6.9 65,19.25 67.25,19.25 IC6.8 67.5,19.25 72.5,19.25 73.5,20.25 R35.3 73.75,20.25 74.75,19.25 86.25,19.25 87.5,18 R36.2
  Bottom 0.305: R40.1 90,10.25 87.75,12.5 87.75,17.75 R36.2
N$68
  Top 0.305: J4.P$3 97.5,6.25 88.5,6.25 J4.P$4
  Bottom 0.305: R36.1 87.75,10 88.25,9.5 88.25,6.25 J4.P$4
N$69
  Bottom 0.305: R35.2 71,23 65,29 65,30.25 IC4.9
N$70
  Top 0.305: RV4.VAR RV4.R2 45.75,5 45.75,9 C8.+
  Bottom 0.305: D8.C 47.5,15 46.75,14.25 46.75,10.25 45.75,9.25 C8.+ 45.75,9 45.75,8.75 59.25,8.75 60.75,10.25 60.75,17.75 62,19 IC6.10
N$71
  Bottom 0.305: RV4.R1 40.5,5 41.25,5.75 41.25,13.75 R28.2
N$72  (via drill 0.3)
  Top 0.305: R40.2 90.25,17.75 92.5,17.75 R48.2 92.75,18 86.75,24 73.75,24 v69.5,28.25
  Bottom 0.305: v69.5,28.25 69.5,37.25 65,41.75 IC2.9
N$73
  Top 0.305: R44.2 78.5,35.5 72.25,35.5 71.25,34.5 R52.1
  Bottom 0.305: IC2.10 62.25,42 64,43.75 70,43.75 70,35.5 71,34.5 R52.1
N$EOC1
  Bottom 0.305: IC1.7 27.5,34.5 33.75,40.75 33.75,42.25 38.5,47 43.25,47 43.25,43.75 45,42 R49.2 45.25,42 46,42 49.5,45.5 JP2.2
N$EOC2
  Top 0.305: IC1.8 27.5,42 34.75,42 R50.2 35,42 36,43 40.5,43 40.5,46 41.5,47 45.5,47 46.75,45.75 JP2.4
N$EOC3
  Top 0.305: IC2.7 67.5,34.25 68.5,33.25 73.75,33.25 74.75,34.25 R51.2
  Bottom 0.305: JP2.6 44.5,45.75 45.75,47 75,47 75,43.25 76,42.25 76,35.5 75,34.5 R51.2
N$EOC4
  Top 0.305: R52.2 71,42 67.5,42 IC2.8 67.25,42 65.5,43.75 43.75,43.75 42,45.5 JP2.8
N$TRG1
  Top 0.305: D1.A 54.5,48.5 53.5,49.5 48,49.5 47,48.5 JP2.3
N$TRG2
  Top 0.305: D2.A 54.5,45.75 54,46.25 50.75,46.25 50,47 46.25,47 45,48.25 44.5,48.25 JP2.5
N$TRG3
  Top 0.305: D3.A 34.5,45.75 35.75,47 40.5,47 41.75,48.25 JP2.7
N$TRG4
  Top 0.305: D4.A 34.5,48.25 39.25,48.25 JP2.9

### Text on the board
bNames: Quad Decay / Main Board / DLP v1.0.1